# Altium project IIS.PrjPcb (part 3 of 3)

## Sheet Dual_Flowmeter.SchDoc
size A; SheetNumber: 15; SheetTotal: 15
Used 2 times, as channels U_Dual_Flowmeter_Interface/U_Dual_Flowmeter, U_Dual_Flowmeter_Interface/U_Dual_Flowmeter. Parts and nets are listed once, with the designators drawn on the sheet.
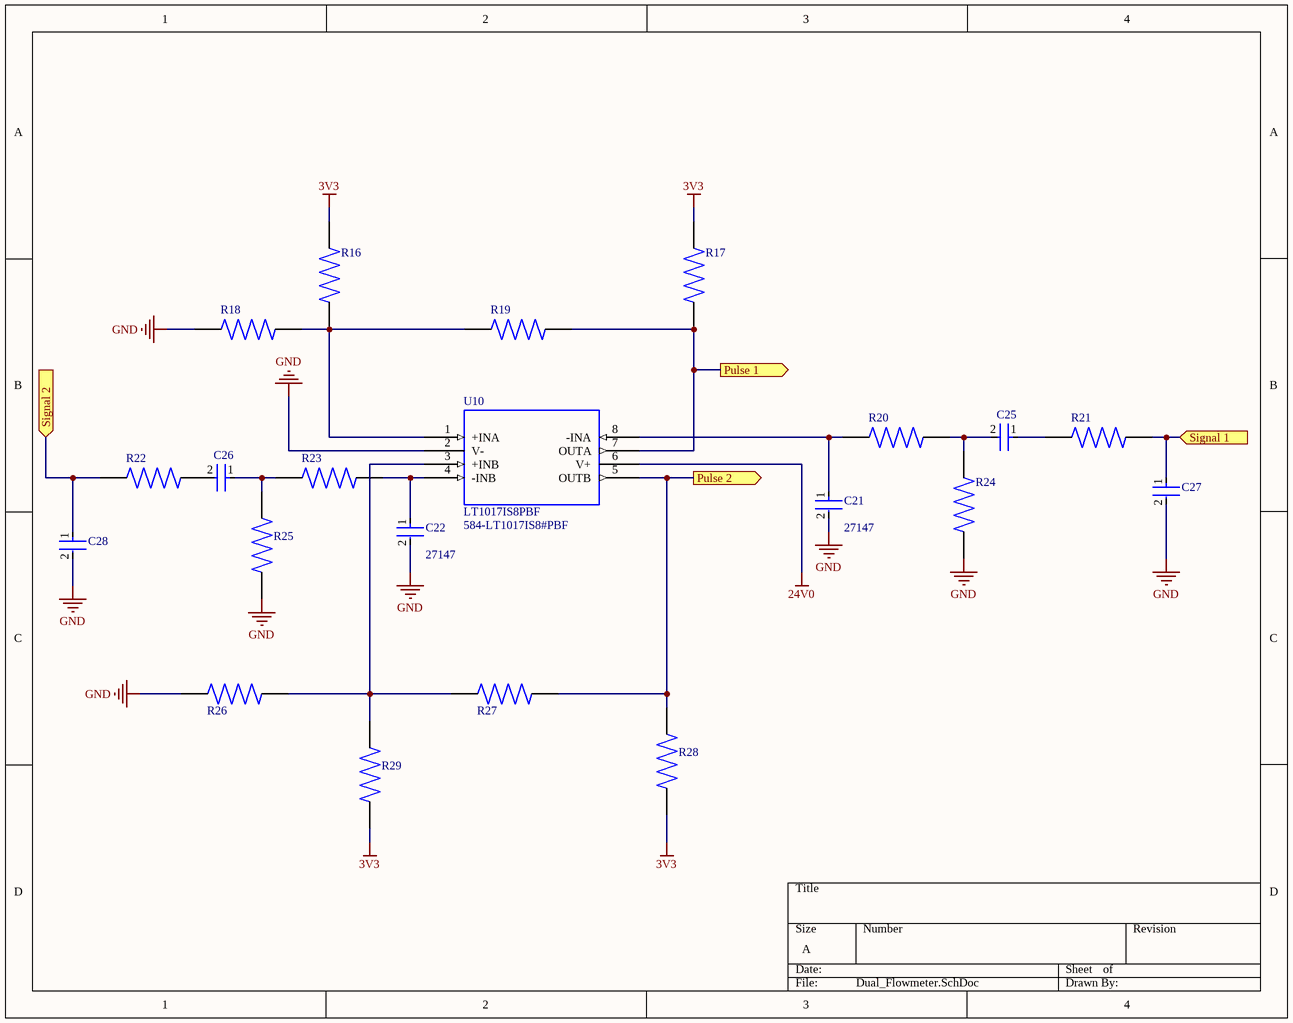
[diagram p13: Dual_Flowmeter.SchDoc]

### Parts
C21  Stock 1: 27147  [FP-C1206C-EB-IPC_A]  (hidden comment: C1206C222K5RACTU)
C22  Stock 1: 27147  [FP-C1206C-EB-IPC_A]  (hidden comment: C1206C222K5RACTU)
C25  GRM21BR61E106KA73L  [FP-GRM21B-0_15-IPC_A]  (value not drawn)
C26  GRM21BR61E106KA73L  [FP-GRM21B-0_15-IPC_A]  (value not drawn)
C27  GRM21BR61E106KA73L  [FP-GRM21B-0_15-IPC_A]  (value not drawn)
C28  GRM21BR61E106KA73L  [FP-GRM21B-0_15-IPC_A]  (value not drawn)
R16  RC1206JR-07100KL  [RESC3116X65N]  (value not drawn)
R17  RC0402FR-073K3P  [RESC1005X40N]  (value not drawn)
R18  CRS2010AFX-1001ELF  [RESC5025X70N]  (value not drawn)
R19  ERJS03F1004V  [RES_ERJS03F1004V]  (value not drawn)
R20  CR0603-JW-512ELF  [RESC1608X55N]  (value not drawn)
R21  RT0603DRE072K21L  [RESC1608X55N]  (value not drawn)
R22  RT0603DRE072K21L  [RESC1608X55N]  (value not drawn)
R23  CR0603-JW-512ELF  [RESC1608X55N]  (value not drawn)
R24  CR0603-JW-512ELF  [RESC1608X55N]  (value not drawn)
R25  CR0603-JW-512ELF  [RESC1608X55N]  (value not drawn)
R26  CRS2010AFX-1001ELF  [RESC5025X70N]  (value not drawn)
R27  ERJS03F1004V  [RES_ERJS03F1004V]  (value not drawn)
R28  RC0402FR-073K3P  [RESC1005X40N]  (value not drawn)
R29  RC1206JR-07100KL  [RESC3116X65N]  (value not drawn)
U10  LT1017IS8PBF  Supplier Part Number 1: 584-LT1017IS8#PBF  [SO-8_S]

### Ports
Pulse 1 (out), Pulse 2 (out), Signal 1 (in), Signal 2 (in)

### Nets
3V3: R16.1 R17.1 R28.1 R29.1
24V0: U10.6(V+)
GND: C21.2 C22.2 C27.2 C28.2 R18.1 R24.2 R25.2 R26.2 U10.2(V-)
Pulse 1: R17.2 R19.2 U10.7(OUTA) ; port Pulse 1
Pulse 2: R27.1 R28.2 U10.5(OUTB) ; port Pulse 2
Signal 1: C27.1 R21.2 ; port Signal 1
Signal 2: C28.1 R22.1 ; port Signal 2
NetC21_1: C21.1 R20.1 U10.8(-INA)
NetC22_1: C22.1 R23.2 U10.4(-INB)
NetC25_1: C25.1 R21.1
NetC25_2: C25.2 R20.2 R24.1
NetC26_1: C26.1 R23.1 R25.1
NetC26_2: C26.2 R22.2
NetR16_2: R16.2 R18.2 R19.1 U10.1(+INA)
NetR26_1: R26.1 R27.2 R29.2 U10.3(+INB)

### Channels
U_Dual_Flowmeter_Interface/U_Dual_Flowmeter: designators end in _U_Dual_Flowmeter_Interface_U_Dual_Flowmeter#1; ports Pulse 1=NetR17_U_Dual_Flowmeter_Interface_U_Dual_Flowmeter#1_2 Pulse 2=NetR27_U_Dual_Flowmeter_Interface_U_Dual_Flowmeter#1_1 Signal 1=NetC27_U_Dual_Flowmeter_Interface_U_Dual_Flowmeter#1_1 Signal 2=NetC28_U_Dual_Flowmeter_Interface_U_Dual_Flowmeter#1_1
U_Dual_Flowmeter_Interface/U_Dual_Flowmeter: designators end in _U_Dual_Flowmeter_Interface_U_Dual_Flowmeter#2; ports Pulse 1=NetR17_U_Dual_Flowmeter_Interface_U_Dual_Flowmeter#2_2 Pulse 2=NetR27_U_Dual_Flowmeter_Interface_U_Dual_Flowmeter#2_1 Signal 1=NetC27_U_Dual_Flowmeter_Interface_U_Dual_Flowmeter#2_1 Signal 2=NetC28_U_Dual_Flowmeter_Interface_U_Dual_Flowmeter#2_1

### Library data of the parts
C21 C22 = C1206C222K5RACTU: CAPACITOR SMD Multilayer Ceramic MLCC 1206 Case 2200pF ±10% 50Vdc X7R Dielectric -55°C~+125°C T/R; Manufacturer: KEMET; Capacitance: 2.2nF; Voltage Rating: 50V; Supplier 1: Digi-Key; Manufacturer Part Number: C1206C222K5RACTU; RoHS: Yes; Category: Ceramic Capacitors; Pricing 1: 1=0.23000, 10=0.16000, 50=0.09600, 100=0.08110, 500=0.05548, 1000=0.04908 (USD); Mount: Surface Mount,PCB; Case/Package: 1206; Case Code (Imperial): 1206; Case Code (Metric): 3216; Dielectric Material: Ceramic; Min Operating Temperature: -55°C; Max Operating Temperature: 125°C; Packaging: Tape and Reel; Package Quantity: 1; Tolerance: 10%; Voltage Rating (DC): 50V; Termination: SMD/SMT; Series: C; Dielectric: X7R; Voltage: 50V; Construction: Flat; Length: 3.2mm; Width: 0.063inch; Height: 0.78mm; Depth: 1.6mm; Thickness: 0.035inch; Radiation Hardening: No; REACH SVHC: No SVHC; RoHS Compliant: Yes; ComponentLink1URL: https://datasheet.ciiva.com/14589/70095383-14589254.pdf?src-supplier=Allied+Electronics; ComponentLink1Description: https://datasheet.ciiva.com/14589/70095383-14589254.pdf?src-supplier=Allied+Electronics; ComponentLink2URL: https://datasheet.ciiva.com/14606/70095383-14606284.pdf?src-supplier=Allied+Electronics; ComponentLink2Description: https://datasheet.ciiva.com/14606/70095383-14606284.pdf?src-supplier=Allied+Electronics; ComponentLink3URL: https://datasheet.ciiva.com/28693/1851736-28693015.pdf?src-supplier=Element14; ComponentLink3Description: https://datasheet.ciiva.com/28693/1851736-28693015.pdf?src-supplier=Element14; ComponentLink4URL: https://datasheet.ciiva.com/46443/1851736-46443542.pdf?src-supplier=Element14; ComponentLink4Description: https://datasheet.ciiva.com/46443/1851736-46443542.pdf?src-supplier=Element14; ComponentLink5URL: https://datasheet.ciiva.com/46385/1851736-46385639.pdf?src-supplier=Element14; ComponentLink5Description: https://datasheet.ciiva.com/46385/1851736-46385639.pdf?src-supplier=Element14; Supplier Part Number 1: 399-C1206C222K5RAC7800CT-ND
C25-C28 = GRM21BR61E106KA73L: 0805 10 uF 25 V ±10% Tolerance X5R SMT Multilayer Ceramic Capacitor; Manufacturer: Murata; Capacitance: 10uF; Voltage Rating: 25V; Supplier 1: Mouser; Manufacturer Part Number: GRM21BR61E106KA73L; RoHS: Yes; Category: Ceramic Capacitors; Pricing 1: 1=0.24000, 10=0.16400, 50=0.16400, 100=0.08400, 1000=0.08400, 6000=0.07600, 9000=0.06200, 10000=0.06200, 24000=0.05400 (USD); Mount: Surface Mount; Case/Package: 0805; Case Code (Metric): 2012; Case Code (Imperial): 0805; Material: Ceramic; Min Operating Temperature: -55°C; Max Operating Temperature: 85°C; Package Quantity: 1; Tolerance: 10%; Packaging: Tape and Reel; Voltage Rating (DC): 25V; Termination: SMD/SMT; Voltage: 25V; Series: GRM; Construction: Flat; Dielectric: X5R; Length: 2mm; Width: 0.049inch; Height: 1.25mm; Depth: 1.25mm; Thickness: 0.053inch; Radiation Hardening: No; REACH SVHC: Unknown; RoHS Compliant: Yes; Lead Free: Lead Free; ComponentLink1URL: https://datasheet.ciiva.com/22774/1747469-22774396.pdf?src-supplier=Farnell; ComponentLink1Description: https://datasheet.ciiva.com/22774/1747469-22774396.pdf?src-supplier=Farnell; ComponentLink2URL: https://datasheet.ciiva.com/5424/product-5424327.pdf?src-supplier=Mouser; ComponentLink2Description: https://datasheet.ciiva.com/5424/product-5424327.pdf?src-supplier=Mouser; ComponentLink3URL: https://datasheet.ciiva.com/16440/grm21br61e106ka73l-16440627.pdf?src-supplier=Future+Electronics; ComponentLink3Description: https://datasheet.ciiva.com/16440/grm21br61e106ka73l-16440627.pdf?src-supplier=Future+Electronics; ComponentLink4URL: https://datasheet.ciiva.com/28584/626718-28584288.pdf?src-supplier=Element14; ComponentLink4Description: https://datasheet.ciiva.com/28584/626718-28584288.pdf?src-supplier=Element14; ComponentLink5URL: https://datasheet.ciiva.com/29199/454623-da-01-en-vs-kondensator-0805-29199615.pdf?src-supplier=Conrad; ComponentLink5Description: https://datasheet.ciiva.com/29199/454623-da-01-en-vs-kondensator-0805-29199615.pdf?src-supplier=Conrad; ComponentLink6URL: https://datasheet.ciiva.com/139/partnumbering-e-01-139182.pdf?src-supplier=Digi-Key; ComponentLink6Description: https://datasheet.ciiva.com/139/partnumbering-e-01-139182.pdf?src-supplier=Digi-Key; ComponentLink7URL: https://datasheet.ciiva.com/139/partnumbering-e-01-139183.pdf?src-supplier=Digi-Key; ComponentLink7Description: https://datasheet.ciiva.com/139/partnumbering-e-01-139183.pdf?src-supplier=Digi-Key; ComponentLink8URL: https://datasheet.ciiva.com/139/partnumbering-e-01-139184.pdf?src-supplier=Digi-Key; ComponentLink8Description: https://datasheet.ciiva.com/139/partnumbering-e-01-139184.pdf?src-supplier=Digi-Key; ComponentLink9URL: https://datasheet.ciiva.com/28584/626718-28584279.pdf?src-supplier=Element14; ComponentLink9Description: https://datasheet.ciiva.com/28584/626718-28584279.pdf?src-supplier=Element14; ComponentLink10URL: https://datasheet.ciiva.com/7719/1747469-7719093.pdf?src-supplier=Element14; ComponentLink10Description: https://datasheet.ciiva.com/7719/1747469-7719093.pdf?src-supplier=Element14; ComponentLink11URL: https://datasheet.ciiva.com/14116/grmseries-highdielectrictype-eng-14116376.pdf?src-supplier=Distrelec; ComponentLink11Description: https://datasheet.ciiva.com/14116/grmseries-highdielectrictype-eng-14116376.pdf?src-supplier=Distrelec; Supplier Part Number 1: 81-GRM21BR61E106KA3L; Stock 1: 513087
R16 R29 = RC1206JR-07100KL: Carbon film resistor 100 kâ„¦ SMD 1206 0.25 W 5 % 200 ppm Yageo RC1206JR-07100KL 1 pc(s); Package: None; Price: None; Value: *; MP: RC1206JR-07100KL; Availability: Unavailable; Supplier 1: Digi-Key; Supplier Part Number 1: 311-100KERCT-ND
R17 R28 = RC0402FR-073K3P: Chip Resistor Surface Mount; Package: None; Price: None; Value: *; MP: RC0402FR-073K3P; Availability: Unavailable; Supplier 1: Digi-Key; Supplier Part Number 1: YAG1267CT-ND
R19 R27 = ERJS03F1004V: Res Thick Film 0603 1M Ohm 1% 0.1W(1/10W) Â±100ppm/Â°C Sulfur Resistant Pad SMD Automotive T/R; MP: ERJ-S03F1004V; MF: Panasonic; Availability: Not in stock; Value: *; Price: None; SnapEDA_Link: https://www.snapeda.com/parts/ERJ-S03F1004V/Panasonic/view-part/3733497/?ref=snap; Check_prices: https://www.snapeda.com/parts/ERJ-S03F1004V/Panasonic/view-part/3733497/?ref=eda; Package: 1608-2 Panasonic; Supplier 1: Mouser; Supplier Part Number 1: 667-ERJ-S03F1004V
R20 R23-R25 = CR0603-JW-512ELF: Resistor Thick Film 0603 5.1k Ohm 5% 1/10 Watt Â±200ppm Â°C Surface Mount Paper Tape On Plastic Reel; Package: None; Price: None; Value: *; MP: CR0603-JW-512ELF; Availability: Unavailable; Supplier 1: Digi-Key; Supplier Part Number 1: 118-CR0603-JW-512ELFCT-ND
R21 R22 = RT0603DRE072K21L: RES SMD 2.21KOHM 0.5% 1/10W 0603; Package: None; Price: None; Value: *; MP: RT0603DRE072K21L; Availability: Unavailable
U10 = LT1017IS8PBF: Comparator General Purpose Pull Up 8-SOIC; MF: Analog Devices; MP: LT1017IS8#PBF; Purchase-URL: https://pricing.snapeda.com/search/part/LT1017IS8#PBF/?ref=eda; Check_prices: https://www.snapeda.com/parts/LT1017IS8%23PBF/Analog%20Devices/view-part/4348316/?ref=eda; Value: *; Package: SOIC -8 Analog Devices; Price: None; Availability: In Stock; SnapEDA_Link: https://www.snapeda.com/parts/LT1017IS8%23PBF/Analog%20Devices/view-part/4348316/?ref=snap; Supplier 1: Mouser
R18 R26 = CRS2010AFX-1001ELF: Package: None; Price: None; Value: *; MP: CRS2010AFX-1001ELF; Availability: Unavailable; Supplier 1: Digi-Key; Supplier Part Number 1: CRS2010AFX-1001ELFCT-ND

## Sheet Button and more.SchDoc
size A; SheetNumber: 3; SheetTotal: 15
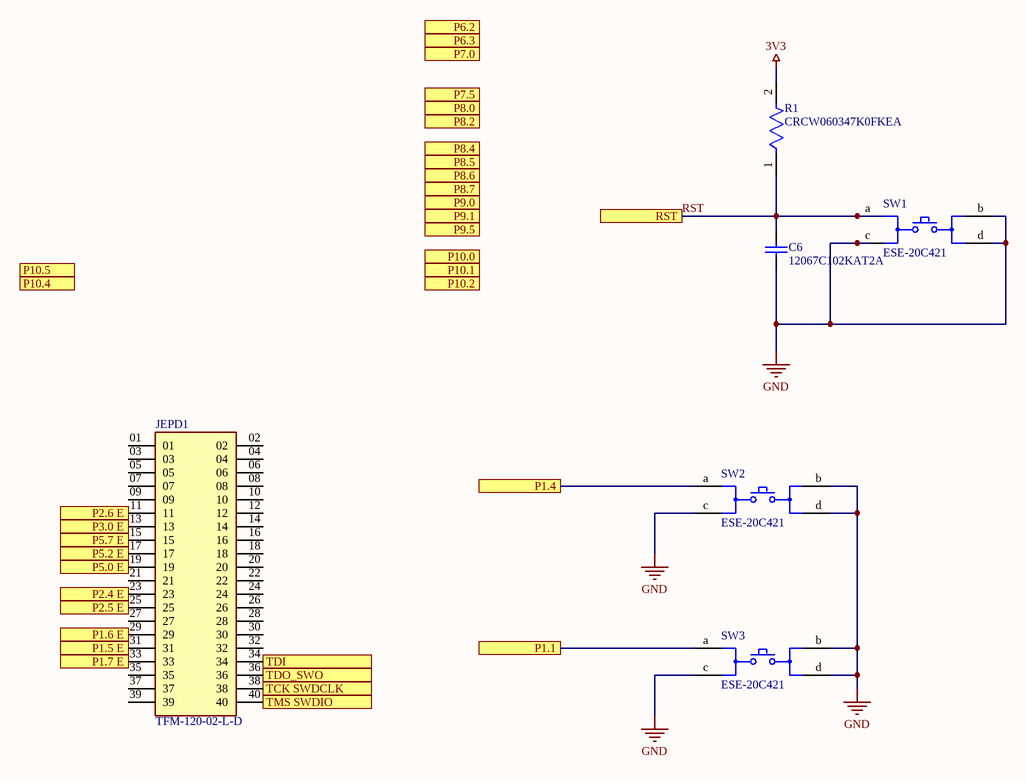
[diagram p14: Button and more.SchDoc]

### Parts
C6  12067C102KAT2A  [CAPC3216X102X50LL20T25]
JEPD1  TFM-120-02-L-D  [SAMTEC_TFM-120-02-L-D]
R1  CRCW060347K0FKEA  [FP-CRCW0603-e3-MFG]
SW1  ESE-20C421  [FP-ESE-20C421-MFG]
SW2  ESE-20C421  [FP-ESE-20C421-MFG]
SW3  ESE-20C421  [FP-ESE-20C421-MFG]

### Ports
P1.1, P1.4, P1.5 E (out), P1.6 E (out), P1.7 E (out), P2.4 E (out), P2.5 E (out), P2.6 E (out), P3.0 E (out), P5.0 E (out), P5.2 E (out), P5.7 E (out), P6.2, P6.3, P7.0, P7.5, P8.0, P8.2, P8.4, P8.5, P8.6, P8.7, P9.0, P9.1, P9.5, P10.0, P10.1, P10.2, P10.4, P10.5, RST, TCK SWDCLK, TDI, TDO_SWO, TMS SWDIO

### Nets
3V3: R1.2
GND: C6.1 SW1.b SW1.c SW1.d SW2.b SW2.c SW2.d SW3.b SW3.c SW3.d
RST: C6.2 R1.1 SW1.a ; port RST
TMS_SWDIO: JEPD1.40 ; port TMS SWDIO
NetJEPD1_11: JEPD1.11 ; port P2.6 E
NetJEPD1_13: JEPD1.13 ; port P3.0 E
NetJEPD1_15: JEPD1.15 ; port P5.7 E
NetJEPD1_17: JEPD1.17 ; port P5.2 E
NetJEPD1_19: JEPD1.19 ; port P5.0 E
NetJEPD1_23: JEPD1.23 ; port P2.4 E
NetJEPD1_25: JEPD1.25 ; port P2.5 E
NetJEPD1_29: JEPD1.29 ; port P1.6 E
NetJEPD1_31: JEPD1.31 ; port P1.5 E
NetJEPD1_33: JEPD1.33 ; port P1.7 E
NetJEPD1_34: JEPD1.34 ; port TDI
NetJEPD1_36: JEPD1.36 ; port TDO_SWO
NetJEPD1_38: JEPD1.38 ; port TCK SWDCLK
NetSW2_a: SW2.a ; port P1.4
NetSW3_a: SW3.a ; port P1.1

Not connected (* = marked no-connect by the designer): JEPD1 01 02 03 04 05 06 07 08 09 10 12 14 16 18 20 21 22 24 26 27 28 30 32 35 37 39

### Notes on the sheet
- Labels drawn without touching a wire or pin: \

### Library data of the parts
C6 = CMP-1037-02486-2: Chip Capacitor, 1 nF, +/- 10%, 500 V, -55 to 125 degC, 1206 (3216 Metric), RoHS, Tape and Reel; Manufacturer: AVX; Rated Voltage: 500V; Dielectric: X7R; Capacitance: 1nF; Manufacturer URL: http://www.avx.com/; Case Size/Dimension: 1206; Package Reference: 1206; Datasheet Version: 07/2016; Datasheet URL: http://datasheets.avx.com/X7RDielectric.pdf; Package Description: 2-Pin Surface Mount Device, Body 3.2 x 1.6 mm; Tolerance (%): ±10%; Mounting Technology: SurfaceMount
JEPD1 = TFM-120-02-L-D: MF: Samtec; Availability: Unavailable; MP: TFM-120-02-L-D; Price: None; Package: None; Value: *
R1 = CMP-2000-03379-3: RES SMD 47K OHM 1% 1/10W 0603; Voltage Rating (DC): 75V; Power Rating: 100mW; Temperature Coefficient: 100ppm/°C; Resistance: 47kR; Package Quantity: 5000; Length: 1.55mm; Case Code (Metric): 1608; Packaging: Tape and Reel; Depth: 0.85mm; Lead Free: Lead Free; Mount: Surface Mount; Termination: SMD/SMT; Military Standard: Not; Tolerance: 1%; Min Operating Temperature: -55°C; Case/Package: 0603; Height: 0.45mm; Voltage Rating: 75V; Case Code (Imperial): 0603; Width: 0.85mm; Weight: 7.1E-05oz; Radiation Hardening: No; Contact Plating: Tin; Max Operating Temperature: 155°C; Size Code: 0603; Technology: THICK FILM; Number of Terminations: 2; Series: CRCW; RoHS Compliant: Yes; Resistance Tolerance: 1%; Max Power Dissipation: 100mW; Resistor Type: Thick Film; Features: Automotive AEC-Q200; Construction: Rectangular
SW1-SW3 = CMP-05613-000006-1: SWITCH PUSH SPST-NO 0.1A 14V; Current Rating: 100mA; Switch Function: Off-Mom; Throw Configuration: SPST; Actuator Type: Lever; Operating Force: 4N; Actuator Length: 5.5mm; Series: ESE20C; Package Quantity: 1200; Radiation Hardening: No; Max Voltage Rating (DC): 14V; Voltage Rating (DC): 14V; Max Operating Temperature: 80°C; Lead Free: Lead Free; Mount: Through Hole; Termination: PC Pin; Packaging: Bulk; Min Operating Temperature: -30°C; RoHS Compliant: Yes; Contact Current Rating: 100mA; REACH SVHC: No SVHC; Orientation: Straight

## Nets that join several sheets
3V3: MCU (6 pins), ESP32 (5 pins), Analog to Digital (U5.26), 3.3V_Regulator (C11.2 C14.1 U4.3), U_Dual_Flowmeter_Interface/U_Dual_Flowmeter (R16_U_Dual_Flowmeter_Interface_U_Dual_Flowmeter#1.1 R17_U_Dual_Flowmeter_Interface_U_Dual_Flowmeter#1.1 R28_U_Dual_Flowmeter_Interface_U_Dual_Flowmeter#1.1 R29_U_Dual_Flowmeter_Interface_U_Dual_Flowmeter#1.1), U_Dual_Flowmeter_Interface/U_Dual_Flowmeter (R16_U_Dual_Flowmeter_Interface_U_Dual_Flowmeter#2.1 R17_U_Dual_Flowmeter_Interface_U_Dual_Flowmeter#2.1 R28_U_Dual_Flowmeter_Interface_U_Dual_Flowmeter#2.1 R29_U_Dual_Flowmeter_Interface_U_Dual_Flowmeter#2.1), Button and more (R1.2)
24V0: 4-20mA_Inputs_(1-3) (J2.1 J3.1 J4.1), 4-20mA_Inputs_(3-6) (J5.1 J6.1 J7.1), 24V_DCDC_Conv (6 pins), U_Dual_Flowmeter_Interface/U_Dual_Flowmeter (U10_U_Dual_Flowmeter_Interface_U_Dual_Flowmeter#1.6), U_Dual_Flowmeter_Interface/U_Dual_Flowmeter (U10_U_Dual_Flowmeter_Interface_U_Dual_Flowmeter#2.6)
A5V0: Analog to Digital (5 pins), U_4-20mA_Inputs_(1-3)/U_4-20mA (U3_U_4-20mA_Inputs_(1-3)_U_4-20mA#1.7), U_4-20mA_Inputs_(1-3)/U_4-20mA (U3_U_4-20mA_Inputs_(1-3)_U_4-20mA#2.7), U_4-20mA_Inputs_(1-3)/U_4-20mA (U3_U_4-20mA_Inputs_(1-3)_U_4-20mA#3.7), U_4-20mA_Inputs_(3-6)/U_4-20mA (U3_U_4-20mA_Inputs_(3-6)_U_4-20mA#1.7), U_4-20mA_Inputs_(3-6)/U_4-20mA (U3_U_4-20mA_Inputs_(3-6)_U_4-20mA#2.7), U_4-20mA_Inputs_(3-6)/U_4-20mA (U3_U_4-20mA_Inputs_(3-6)_U_4-20mA#3.7), 5V_DCDC_Conv (C15.1 C23.1 L1.2 U7.4), 3.3V_Regulator (C10.2 C13.1 U4.1)
GND: MCU (14 pins), ESP32 (32 pins), HFX LFX (CH1.1 CH2.1 CL1.1 CL2.1), Analog to Digital (15 pins), 4-20mA_Inputs_(1-3) (J2.4 J3.4 J4.4), U_4-20mA_Inputs_(1-3)/U_4-20mA (CF3_U_4-20mA_Inputs_(1-3)_U_4-20mA#1.2 U3_U_4-20mA_Inputs_(1-3)_U_4-20mA#1.1 U3_U_4-20mA_Inputs_(1-3)_U_4-20mA#1.4), U_4-20mA_Inputs_(1-3)/U_4-20mA (CF3_U_4-20mA_Inputs_(1-3)_U_4-20mA#2.2 U3_U_4-20mA_Inputs_(1-3)_U_4-20mA#2.1 U3_U_4-20mA_Inputs_(1-3)_U_4-20mA#2.4), U_4-20mA_Inputs_(1-3)/U_4-20mA (CF3_U_4-20mA_Inputs_(1-3)_U_4-20mA#3.2 U3_U_4-20mA_Inputs_(1-3)_U_4-20mA#3.1 U3_U_4-20mA_Inputs_(1-3)_U_4-20mA#3.4), 4-20mA_Inputs_(3-6) (J5.4 J6.4 J7.4), U_4-20mA_Inputs_(3-6)/U_4-20mA (CF3_U_4-20mA_Inputs_(3-6)_U_4-20mA#1.2 U3_U_4-20mA_Inputs_(3-6)_U_4-20mA#1.1 U3_U_4-20mA_Inputs_(3-6)_U_4-20mA#1.4), U_4-20mA_Inputs_(3-6)/U_4-20mA (CF3_U_4-20mA_Inputs_(3-6)_U_4-20mA#2.2 U3_U_4-20mA_Inputs_(3-6)_U_4-20mA#2.1 U3_U_4-20mA_Inputs_(3-6)_U_4-20mA#2.4), U_4-20mA_Inputs_(3-6)/U_4-20mA (CF3_U_4-20mA_Inputs_(3-6)_U_4-20mA#3.2 U3_U_4-20mA_Inputs_(3-6)_U_4-20mA#3.1 U3_U_4-20mA_Inputs_(3-6)_U_4-20mA#3.4), PowerSystem (7 pins), 5V_DCDC_Conv (8 pins), 3.3V_Regulator (6 pins), 24V_DCDC_Conv (21 pins), U_Dual_Flowmeter_Interface/U_Dual_Flowmeter (9 pins), U_Dual_Flowmeter_Interface/U_Dual_Flowmeter (9 pins), Button and more (10 pins)
Vin: PowerSystem (7 pins), 5V_DCDC_Conv (C16.1 C17.1 U7.2), 24V_DCDC_Conv (9 pins)
Net_U_1_U_4-20mA_Inputs_(1-3)_U_4-20mA#1_2: 4-20mA_Inputs_(1-3) (J2.3), U_4-20mA_Inputs_(1-3)/U_4-20mA (5 pins)
Net_U_1_U_4-20mA_Inputs_(1-3)_U_4-20mA#2_2: 4-20mA_Inputs_(1-3) (J3.3), U_4-20mA_Inputs_(1-3)/U_4-20mA (5 pins)
Net_U_1_U_4-20mA_Inputs_(1-3)_U_4-20mA#3_2: 4-20mA_Inputs_(1-3) (J4.3), U_4-20mA_Inputs_(1-3)/U_4-20mA (5 pins)
Net_U_1_U_4-20mA_Inputs_(3-6)_U_4-20mA#1_2: 4-20mA_Inputs_(3-6) (J5.3), U_4-20mA_Inputs_(3-6)/U_4-20mA (5 pins)
Net_U_1_U_4-20mA_Inputs_(3-6)_U_4-20mA#2_2: 4-20mA_Inputs_(3-6) (J6.3), U_4-20mA_Inputs_(3-6)/U_4-20mA (5 pins)
Net_U_1_U_4-20mA_Inputs_(3-6)_U_4-20mA#3_2: 4-20mA_Inputs_(3-6) (J7.3), U_4-20mA_Inputs_(3-6)/U_4-20mA (5 pins)
NetCF3_U_4-20mA_Inputs_(1-3)_U_4-20mA#1_1: Analog to Digital (U5.7), U_4-20mA_Inputs_(1-3)/U_4-20mA (CF3_U_4-20mA_Inputs_(1-3)_U_4-20mA#1.1 RF1_U_4-20mA_Inputs_(1-3)_U_4-20mA#1.2)
NetCF3_U_4-20mA_Inputs_(1-3)_U_4-20mA#2_1: Analog to Digital (U5.8), U_4-20mA_Inputs_(1-3)/U_4-20mA (CF3_U_4-20mA_Inputs_(1-3)_U_4-20mA#2.1 RF1_U_4-20mA_Inputs_(1-3)_U_4-20mA#2.2)
NetCF3_U_4-20mA_Inputs_(1-3)_U_4-20mA#3_1: Analog to Digital (U5.9), U_4-20mA_Inputs_(1-3)/U_4-20mA (CF3_U_4-20mA_Inputs_(1-3)_U_4-20mA#3.1 RF1_U_4-20mA_Inputs_(1-3)_U_4-20mA#3.2)
NetCF3_U_4-20mA_Inputs_(3-6)_U_4-20mA#1_1: Analog to Digital (U5.10), U_4-20mA_Inputs_(3-6)/U_4-20mA (CF3_U_4-20mA_Inputs_(3-6)_U_4-20mA#1.1 RF1_U_4-20mA_Inputs_(3-6)_U_4-20mA#1.2)
NetCF3_U_4-20mA_Inputs_(3-6)_U_4-20mA#2_1: Analog to Digital (U5.11), U_4-20mA_Inputs_(3-6)/U_4-20mA (CF3_U_4-20mA_Inputs_(3-6)_U_4-20mA#2.1 RF1_U_4-20mA_Inputs_(3-6)_U_4-20mA#2.2)
NetCF3_U_4-20mA_Inputs_(3-6)_U_4-20mA#3_1: Analog to Digital (U5.15), U_4-20mA_Inputs_(3-6)/U_4-20mA (CF3_U_4-20mA_Inputs_(3-6)_U_4-20mA#3.1 RF1_U_4-20mA_Inputs_(3-6)_U_4-20mA#3.2)
NetCH1_2: MCU (U1.85), HFX LFX (CH1.2 Y2.2)
NetCH2_2: MCU (U1.86), HFX LFX (CH2.2 Y2.1)
NetCL1_2: MCU (U1.41), HFX LFX (CL1.2 Y1.2)
NetCL2_2: MCU (U1.42), HFX LFX (CL2.2 Y1.1)
NetF1_U_4-20mA_Inputs_(1-3)_U_4-20mA#1_1: 4-20mA_Inputs_(1-3) (J2.2), U_4-20mA_Inputs_(1-3)/U_4-20mA (F1_U_4-20mA_Inputs_(1-3)_U_4-20mA#1.1)
NetF1_U_4-20mA_Inputs_(1-3)_U_4-20mA#2_1: 4-20mA_Inputs_(1-3) (J3.2), U_4-20mA_Inputs_(1-3)/U_4-20mA (F1_U_4-20mA_Inputs_(1-3)_U_4-20mA#2.1)
NetF1_U_4-20mA_Inputs_(1-3)_U_4-20mA#3_1: 4-20mA_Inputs_(1-3) (J4.2), U_4-20mA_Inputs_(1-3)/U_4-20mA (F1_U_4-20mA_Inputs_(1-3)_U_4-20mA#3.1)
NetF1_U_4-20mA_Inputs_(3-6)_U_4-20mA#1_1: 4-20mA_Inputs_(3-6) (J5.2), U_4-20mA_Inputs_(3-6)/U_4-20mA (F1_U_4-20mA_Inputs_(3-6)_U_4-20mA#1.1)
NetF1_U_4-20mA_Inputs_(3-6)_U_4-20mA#2_1: 4-20mA_Inputs_(3-6) (J6.2), U_4-20mA_Inputs_(3-6)/U_4-20mA (F1_U_4-20mA_Inputs_(3-6)_U_4-20mA#2.1)
NetF1_U_4-20mA_Inputs_(3-6)_U_4-20mA#3_1: 4-20mA_Inputs_(3-6) (J7.2), U_4-20mA_Inputs_(3-6)/U_4-20mA (F1_U_4-20mA_Inputs_(3-6)_U_4-20mA#3.1)
NetJEPD1_11: MCU (U1.64), Button and more (JEPD1.11)
NetJEPD1_13: MCU (U1.32), Button and more (JEPD1.13)
NetJEPD1_15: MCU (U1.22), Button and more (JEPD1.15)
NetJEPD1_17: MCU (U1.71), Button and more (JEPD1.17)
NetJEPD1_19: MCU (U1.66), Button and more (JEPD1.19)
NetJEPD1_23: MCU (U1.21), Button and more (JEPD1.23)
NetJEPD1_25: MCU (U1.20), Button and more (JEPD1.25)
NetJEPD1_29: MCU (U1.11), Button and more (JEPD1.29)
NetJEPD1_31: MCU (U1.10), Button and more (JEPD1.31)
NetJEPD1_33: MCU (U1.9), Button and more (JEPD1.33)
NetJEPD1_34: MCU (U1.92), Button and more (JEPD1.34)
NetJEPD1_36: MCU (U1.93), Button and more (JEPD1.36)
NetJEPD1_38: MCU (U1.95), Button and more (JEPD1.38)
NetR17_U_Dual_Flowmeter_Interface_U_Dual_Flowmeter#1_2: MCU (U1.58), U_Dual_Flowmeter_Interface/U_Dual_Flowmeter (R17_U_Dual_Flowmeter_Interface_U_Dual_Flowmeter#1.2 R19_U_Dual_Flowmeter_Interface_U_Dual_Flowmeter#1.2 U10_U_Dual_Flowmeter_Interface_U_Dual_Flowmeter#1.7)
NetR17_U_Dual_Flowmeter_Interface_U_Dual_Flowmeter#2_2: MCU (U1.89), U_Dual_Flowmeter_Interface/U_Dual_Flowmeter (R17_U_Dual_Flowmeter_Interface_U_Dual_Flowmeter#2.2 R19_U_Dual_Flowmeter_Interface_U_Dual_Flowmeter#2.2 U10_U_Dual_Flowmeter_Interface_U_Dual_Flowmeter#2.7)
NetR27_U_Dual_Flowmeter_Interface_U_Dual_Flowmeter#1_1: MCU (U1.47), U_Dual_Flowmeter_Interface/U_Dual_Flowmeter (R27_U_Dual_Flowmeter_Interface_U_Dual_Flowmeter#1.1 R28_U_Dual_Flowmeter_Interface_U_Dual_Flowmeter#1.2 U10_U_Dual_Flowmeter_Interface_U_Dual_Flowmeter#1.5)
NetR27_U_Dual_Flowmeter_Interface_U_Dual_Flowmeter#2_1: MCU (U1.90), U_Dual_Flowmeter_Interface/U_Dual_Flowmeter (R27_U_Dual_Flowmeter_Interface_U_Dual_Flowmeter#2.1 R28_U_Dual_Flowmeter_Interface_U_Dual_Flowmeter#2.2 U10_U_Dual_Flowmeter_Interface_U_Dual_Flowmeter#2.5)
NetSW2_a: MCU (U1.8), Button and more (SW2.a)
NetSW3_a: MCU (U1.5), Button and more (SW3.a)
NetU1_17: MCU (U1.17), Analog to Digital (U5.20)
NetU1_18: MCU (U1.18), Analog to Digital (U5.24)
NetU1_19: MCU (U1.19), Analog to Digital (U5.23)
NetU1_61: MCU (U1.61), Analog to Digital (U5.22)
NetU1_62: MCU (U1.62), Analog to Digital (U5.21)
NetU1_63: MCU (U1.63), Analog to Digital (U5.19)
NetU1_98: MCU (U1.98), ESP32 (U2.27)
NetU1_99: MCU (U1.99), ESP32 (U2.28)
RST: MCU (U1.83), Button and more (C6.2 R1.1 SW1.a)
TMS_SWDIO: MCU (U1.94), Button and more (JEPD1.40)